# Altium schematic sheet Connectors.SchDoc
size B; Author: E. Sims; Organization: Let's Build Rockets Inc.; SheetNumber: 1; SheetTotal: 2
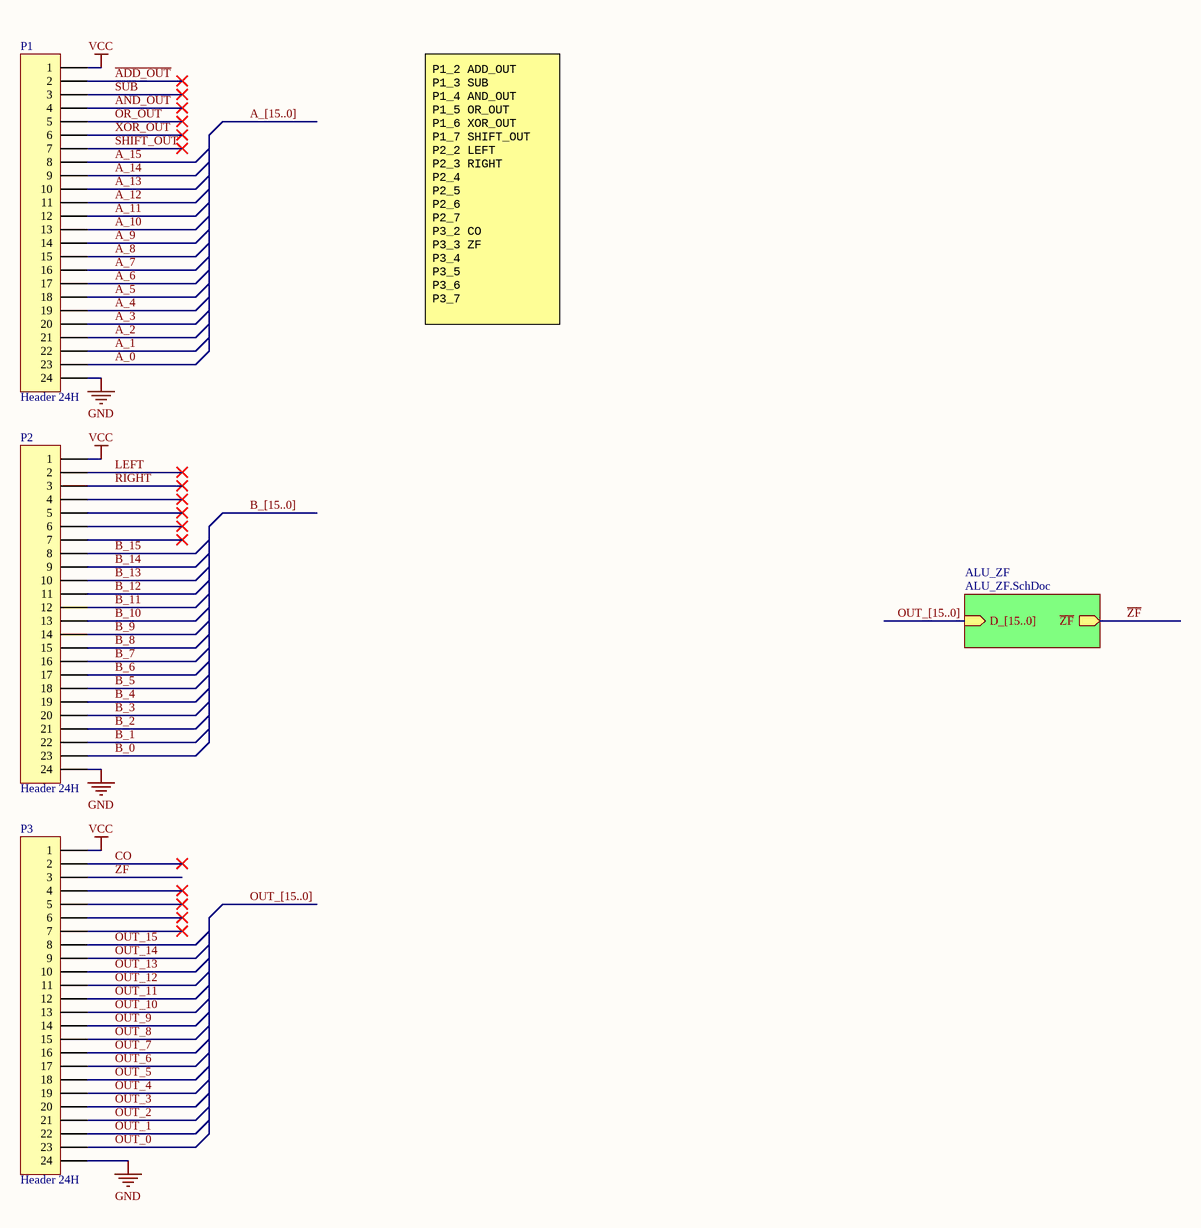
[diagram p0: Connectors.SchDoc]

## Parts
P1  Header 24H  [HDR1X24H]
P2  Header 24H  [HDR1X24H]
P3  Header 24H  [HDR1X24H]

## Sub-sheets
ALU_ZF = ALU_ZF.SchDoc: D_[15..0] (in), ~{ZF} (out)

## Nets
GND: P1.24 P2.24 P3.24
VCC: P1.1 P2.1 P3.1
~{ADD_OUT}: P1.2
~{AND_OUT}: P1.4
A_0: P1.23
A_1: P1.22
A_2: P1.21
A_3: P1.20
A_4: P1.19
A_5: P1.18
A_6: P1.17
A_7: P1.16
A_8: P1.15
A_9: P1.14
A_10: P1.13
A_11: P1.12
A_12: P1.11
A_13: P1.10
A_14: P1.9
A_15: P1.8
B_0: P2.23
B_1: P2.22
B_2: P2.21
B_3: P2.20
B_4: P2.19
B_5: P2.18
B_6: P2.17
B_7: P2.16
B_8: P2.15
B_9: P2.14
B_10: P2.13
B_11: P2.12
B_12: P2.11
B_13: P2.10
B_14: P2.9
B_15: P2.8
CO: P3.2
LEFT: P2.2
~{OR_OUT}: P1.5
OUT_0: P3.23
OUT_1: P3.22
OUT_2: P3.21
OUT_3: P3.20
OUT_4: P3.19
OUT_5: P3.18
OUT_6: P3.17
OUT_7: P3.16
OUT_8: P3.15
OUT_9: P3.14
OUT_10: P3.13
OUT_11: P3.12
OUT_12: P3.11
OUT_13: P3.10
OUT_14: P3.9
OUT_15: P3.8
RIGHT: P2.3
~{SHIFT_OUT}: P1.7
SUB: P1.3
~{XOR_OUT}: P1.6
~{ZF}: P3.3 ; sheet ALU_ZF/~{ZF}

Not connected (* = marked no-connect by the designer): P2 4* 5* 6* 7*; P3 4* 5* 6* 7*

## Buses and harness runs
bus A_[15..0]
bus B_[15..0]
bus OUT_[15..0]
bus OUT_[15..0] = sheet ALU_ZF/D_[15..0]

## Notes on the sheet
- P1_2 ADD_OUT
  P1_3 SUB
  P1_4 AND_OUT
  P1_5 OR_OUT
  P1_6 XOR_OUT
  P1_7 SHIFT_OUT
  P2_2 LEFT
  P2_3 RIGHT
  P2_4
  P2_5
  P2_6
  P2_7
  P3_2 CO
  P3_3 ZF
  P3_4
  P3_5
  P3_6
  P3_7
- Let's Build Rocket's Inc. Modular Paylaod System Based on TMP-010 Rev
  For more information visit https://github.com/LetsBuildRockets/Modular-Payload-System
  This work is licensed under CC BY-NC 4.0. To view a copy of this license, visit https://creativecommons.org/licenses/by-nc/4.0
- Title
- Size:
- Date:
- Assembly Variant:
- B
- Number:
- Time:
- Revision:
- Sheet
- of
- Author:
- File:

## Library data of the parts
P1-P3 = Header 24H: Header, 24-Pin, Right Angle; LatestRevisionDate: 17-Jul-2002; LatestRevisionNote: Re-released for DXP Platform.; Publisher: Altium Limited